# Altium schematic sheet Main.SchDoc: LC_LPF-16-20
size A4; DocumentNumber: 2; SheetNumber: 1; SheetTotal: 2
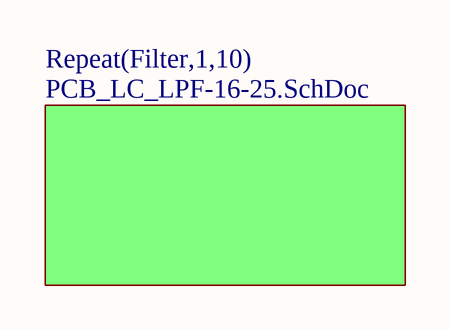
[diagram p0: Main.SchDoc]

## Sub-sheets
Repeat(Filter,1,10) = PCB_LC_LPF-16-25.SchDoc: no entries

## Notes on the sheet
- DOCUMENT NAME:
- TITLE:
- This document is created by Mitai. Any further questions can be asked through
- AUTHOR :
- REVIEWER:
- Sheet
- PART NO.:
- of
- *
- DATE:
- TEMPLATE:
- team@mitai.ai.
- A4
- Contact Address:Rosenheimer Straße 116b,81669, München.